# Altium project CubeSat-Backplane.PrjPcb (part 2 of 2)

## Sheet LED DRIVER.SchDoc: LED DRIVER
size B; CompanyName: ENGINEERING & TECHNICAL SERVICES; DrawnBy: C. Kornowski; Engineer: C. Kornowski; Organization: TECHNOLOGY DEVELOPMENT & ENGINEERING CENTER; Address1: 11401 HOOVER ROAD; Address2: MILAN, OH  44846; DocumentNumber: RD17-700*; SheetNumber: 5; PageSetup: Record=PageOptions|CenterHorizontal=True|CenterVertical=True|PrintScale=1.09|XCorrection=1.00|YCorrection=1.00|PrintKind=1|BorderSize=5000000|LeftOffset=0|BottomOffset=0|Orientation=2|PaperLength=1000|PaperWidth=1000|Scale=100|PaperSource=7|PrintQuality=600|MediaType=1|DitherType=10|PaperKind=11x17|PrintScaleMode=1
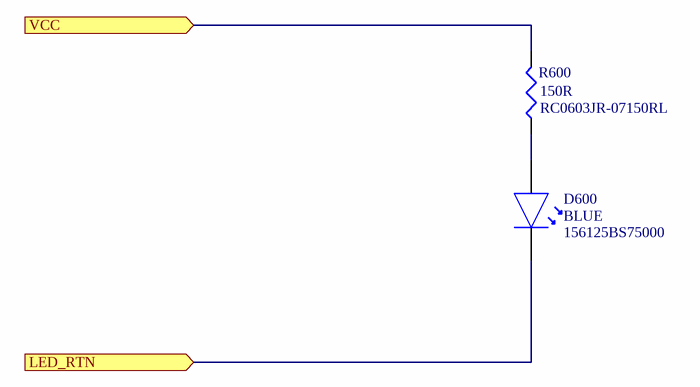
[diagram p4: LED DRIVER.SchDoc]

### Parts
D600  BLUE  [WL-SMRW_1205_BLU]
R600  150R  Manufacturer Part Number 1: RC0603JR-07150RL  [0603]

### Ports
LED_RTN (in), VCC (in)

### Nets
LED_RTN: D600.K ; port LED_RTN
VCC: R600.2 ; port VCC
NetD600_A: D600.A R600.1

### Notes on the sheet
- DCN
- REV
- DESCRIPTION
- REVISION HISTORY
- DATE
- APPROVED
- SIZE
- TITLE
- CAGE CODE
- DWG NO.
- DRAWN BY
- B
- 01HY9
- ENGINEER
- FILE NAME
- SHEET
- PRINTED:
- OF

### Library data of the parts
D600 = 156125BS75000: WL-SMRW SMD MONO-COLOR REVERSE MOUNT. Blue 470nm LED Indication - Discrete 3.2V 1205 (3212 Metric); Manufacturer 1: Wurth Electronics; Supplier 1: Digi-Key; Supplier Part Number 1: 732-13392-1-ND; Stock 1: 2740; Pricing 1: 1=0.40000, 10=0.34800, 100=0.31000, 500=0.28200, 1000=0.26156 (USD); RoHS: No; Manufacturer Part Number 1: 156125BS75000
R600 = RES1: RES SMD 150 OHM 5% 1/10W 0603; Manufacturer 1: Yageo; Voltage Rating (DC): 50V; Temperature Coefficient: 100ppm/°C; Power Rating: 100mW; ComponentLink1URL: https://datasheet.ciiva.com/2454/pyu-r-int-thick-7-2454513.pdf?src-supplier=Digi-Key; ComponentLink1Description: https://datasheet.ciiva.com/2454/pyu-r-int-thick-7-2454513.pdf?src-supplier=Digi-Key; ComponentLink2URL: https://datasheet.ciiva.com/2454/pyu-r-int-thick-7-2454514.pdf?src-supplier=Digi-Key; ComponentLink2Description: https://datasheet.ciiva.com/2454/pyu-r-int-thick-7-2454514.pdf?src-supplier=Digi-Key; ComponentLink3URL: https://datasheet.ciiva.com/2454/pyu-r-int-thick-7-2454515.pdf?src-supplier=Digi-Key; ComponentLink3Description: https://datasheet.ciiva.com/2454/pyu-r-int-thick-7-2454515.pdf?src-supplier=Digi-Key; ComponentLink4URL: https://datasheet.ciiva.com/46440/1868787-46440895.pdf?src-supplier=Element14; ComponentLink4Description: https://datasheet.ciiva.com/46440/1868787-46440895.pdf?src-supplier=Element14; Supplier 1: Digi-Key; Supplier Part Number 1: 311-150GRCT-ND; Stock 1: 2413445; Pricing 1: 1=0.10000, 10=0.01900, 100=0.00770, 1000=0.00347, 2500=0.00301 (USD); RoHS: Yes; Case/Package: 0603; Number of Pins: 2; Case Code (Imperial): 0603; Case Code (Metric): 1608; Min Operating Temperature: -55°C; Max Operating Temperature: 155°C; Value: 150R; Tolerance: 5%; Packaging: Tape and Reel; Composition: Thick Film; Voltage Rating: 50V; Termination: SMD/SMT; Military Standard: Not; Length: 1.6mm; Width: 0.8mm; Depth: 0.8mm; REACH SVHC: No SVHC; Lead Free: Lead Free; ComponentLink5URL: https://datasheet.ciiva.com/7746/443971-7746441.pdf?src-supplier=Element14; ComponentLink5Description: https://datasheet.ciiva.com/7746/443971-7746441.pdf?src-supplier=Element14; ComponentLink6URL: https://datasheet.ciiva.com/7746/443971-7746442.pdf?src-supplier=Element14; ComponentLink6Description: https://datasheet.ciiva.com/7746/443971-7746442.pdf?src-supplier=Element14; ComponentLink7URL: https://datasheet.ciiva.com/46395/443971-46395087.pdf?src-supplier=Element14; ComponentLink7Description: https://datasheet.ciiva.com/46395/443971-46395087.pdf?src-supplier=Element14

## Nets that join several sheets
GND: CubeSat Backplane (23 pins), PCB_CON1 (5 pins), PCB_CON2 (5 pins), PCB_CON3 (5 pins), PCB_CON4 (5 pins), PCB_CON5 (5 pins), PCB_CON6 (5 pins), PCB_CON7 (5 pins), PCB_CON8 (5 pins), Backplane LED's (7 pins)
5V_USB: PCB_CON1 (J200_1.70), PCB_CON2 (J200_2.70), PCB_CON3 (J200_3.70), PCB_CON4 (J200_4.70), PCB_CON5 (J200_5.70), PCB_CON6 (J200_6.70), PCB_CON7 (J200_7.70), PCB_CON8 (J200_8.70), Backplane LED's (9 pins)
+X_SOLAR_PWR: CubeSat Backplane (J105.1), PCB_CON1 (J200_1.8), PCB_CON2 (J200_2.8), PCB_CON3 (J200_3.8), PCB_CON4 (J200_4.8), PCB_CON5 (J200_5.8), PCB_CON6 (J200_6.8), PCB_CON7 (J200_7.8), PCB_CON8 (J200_8.8)
+X_SOLAR_RTN: CubeSat Backplane (J105.2), PCB_CON1 (J200_1.6), PCB_CON2 (J200_2.6), PCB_CON3 (J200_3.6), PCB_CON4 (J200_4.6), PCB_CON5 (J200_5.6), PCB_CON6 (J200_6.6), PCB_CON7 (J200_7.6), PCB_CON8 (J200_8.6)
+X_SOLAR_TLE: CubeSat Backplane (J105.3), PCB_CON1 (J200_1.4), PCB_CON2 (J200_2.4), PCB_CON3 (J200_3.4), PCB_CON4 (J200_4.4), PCB_CON5 (J200_5.4), PCB_CON6 (J200_6.4), PCB_CON7 (J200_7.4), PCB_CON8 (J200_8.4)
+Y_SOLAR_PWR: CubeSat Backplane (J107.1), PCB_CON1 (J200_1.117), PCB_CON2 (J200_2.117), PCB_CON3 (J200_3.117), PCB_CON4 (J200_4.117), PCB_CON5 (J200_5.117), PCB_CON6 (J200_6.117), PCB_CON7 (J200_7.117), PCB_CON8 (J200_8.117)
+Y_SOLAR_RTN: CubeSat Backplane (J107.2), PCB_CON1 (J200_1.115), PCB_CON2 (J200_2.115), PCB_CON3 (J200_3.115), PCB_CON4 (J200_4.115), PCB_CON5 (J200_5.115), PCB_CON6 (J200_6.115), PCB_CON7 (J200_7.115), PCB_CON8 (J200_8.115)
+Y_SOLAR_TLE: CubeSat Backplane (J107.3), PCB_CON1 (J200_1.113), PCB_CON2 (J200_2.113), PCB_CON3 (J200_3.113), PCB_CON4 (J200_4.113), PCB_CON5 (J200_5.113), PCB_CON6 (J200_6.113), PCB_CON7 (J200_7.113), PCB_CON8 (J200_8.113)
-X_SOLAR_PWR: CubeSat Backplane (J106.1), PCB_CON1 (J200_1.118), PCB_CON2 (J200_2.118), PCB_CON3 (J200_3.118), PCB_CON4 (J200_4.118), PCB_CON5 (J200_5.118), PCB_CON6 (J200_6.118), PCB_CON7 (J200_7.118), PCB_CON8 (J200_8.118)
-X_SOLAR_RTN: CubeSat Backplane (J106.2), PCB_CON1 (J200_1.116), PCB_CON2 (J200_2.116), PCB_CON3 (J200_3.116), PCB_CON4 (J200_4.116), PCB_CON5 (J200_5.116), PCB_CON6 (J200_6.116), PCB_CON7 (J200_7.116), PCB_CON8 (J200_8.116)
-X_SOLAR_TLE: CubeSat Backplane (J106.3), PCB_CON1 (J200_1.114), PCB_CON2 (J200_2.114), PCB_CON3 (J200_3.114), PCB_CON4 (J200_4.114), PCB_CON5 (J200_5.114), PCB_CON6 (J200_6.114), PCB_CON7 (J200_7.114), PCB_CON8 (J200_8.114)
-Z_SOLAR_PWR: CubeSat Backplane (J100.9), PCB_CON1 (J200_1.7), PCB_CON2 (J200_2.7), PCB_CON3 (J200_3.7), PCB_CON4 (J200_4.7), PCB_CON5 (J200_5.7), PCB_CON6 (J200_6.7), PCB_CON7 (J200_7.7), PCB_CON8 (J200_8.7)
-Z_SOLAR_RTN: CubeSat Backplane (J100.10), PCB_CON1 (J200_1.5), PCB_CON2 (J200_2.5), PCB_CON3 (J200_3.5), PCB_CON4 (J200_4.5), PCB_CON5 (J200_5.5), PCB_CON6 (J200_6.5), PCB_CON7 (J200_7.5), PCB_CON8 (J200_8.5)
-Z_SOLAR_TLE: CubeSat Backplane (J100.11), PCB_CON1 (J200_1.3), PCB_CON2 (J200_2.3), PCB_CON3 (J200_3.3), PCB_CON4 (J200_4.3), PCB_CON5 (J200_5.3), PCB_CON6 (J200_6.3), PCB_CON7 (J200_7.3), PCB_CON8 (J200_8.3)
AGND: PCB_CON1 (J200_1.71), PCB_CON2 (J200_2.71), PCB_CON3 (J200_3.71), PCB_CON4 (J200_4.71), PCB_CON5 (J200_5.71), PCB_CON6 (J200_6.71), PCB_CON7 (J200_7.71), PCB_CON8 (J200_8.71)
BUS_RESET: CubeSat Backplane (S100.1), PCB_CON1 (J200_1.65), PCB_CON2 (J200_2.65), PCB_CON3 (J200_3.65), PCB_CON4 (J200_4.65), PCB_CON5 (J200_5.65), PCB_CON6 (J200_6.65), PCB_CON7 (J200_7.65), PCB_CON8 (J200_8.65)
NetJ200_1_9: PCB_CON1 (J200_1.9), PCB_CON2 (J200_2.9), PCB_CON3 (J200_3.9), PCB_CON4 (J200_4.9), PCB_CON5 (J200_5.9), PCB_CON6 (J200_6.9), PCB_CON7 (J200_7.9), PCB_CON8 (J200_8.9)
NetJ200_1_10: PCB_CON1 (J200_1.10), PCB_CON2 (J200_2.10), PCB_CON3 (J200_3.10), PCB_CON4 (J200_4.10), PCB_CON5 (J200_5.10), PCB_CON6 (J200_6.10), PCB_CON7 (J200_7.10), PCB_CON8 (J200_8.10)
NetJ200_1_11: PCB_CON1 (J200_1.11), PCB_CON2 (J200_2.11), PCB_CON3 (J200_3.11), PCB_CON4 (J200_4.11), PCB_CON5 (J200_5.11), PCB_CON6 (J200_6.11), PCB_CON7 (J200_7.11), PCB_CON8 (J200_8.11)
NetJ200_1_12: PCB_CON1 (J200_1.12), PCB_CON2 (J200_2.12), PCB_CON3 (J200_3.12), PCB_CON4 (J200_4.12), PCB_CON5 (J200_5.12), PCB_CON6 (J200_6.12), PCB_CON7 (J200_7.12), PCB_CON8 (J200_8.12)
NetJ200_1_13: PCB_CON1 (J200_1.13), PCB_CON2 (J200_2.13), PCB_CON3 (J200_3.13), PCB_CON4 (J200_4.13), PCB_CON5 (J200_5.13), PCB_CON6 (J200_6.13), PCB_CON7 (J200_7.13), PCB_CON8 (J200_8.13)
NetJ200_1_14: PCB_CON1 (J200_1.14), PCB_CON2 (J200_2.14), PCB_CON3 (J200_3.14), PCB_CON4 (J200_4.14), PCB_CON5 (J200_5.14), PCB_CON6 (J200_6.14), PCB_CON7 (J200_7.14), PCB_CON8 (J200_8.14)
NetJ200_1_15: PCB_CON1 (J200_1.15), PCB_CON2 (J200_2.15), PCB_CON3 (J200_3.15), PCB_CON4 (J200_4.15), PCB_CON5 (J200_5.15), PCB_CON6 (J200_6.15), PCB_CON7 (J200_7.15), PCB_CON8 (J200_8.15)
NetJ200_1_16: PCB_CON1 (J200_1.16), PCB_CON2 (J200_2.16), PCB_CON3 (J200_3.16), PCB_CON4 (J200_4.16), PCB_CON5 (J200_5.16), PCB_CON6 (J200_6.16), PCB_CON7 (J200_7.16), PCB_CON8 (J200_8.16)
NetJ200_1_17: PCB_CON1 (J200_1.17), PCB_CON2 (J200_2.17), PCB_CON3 (J200_3.17), PCB_CON4 (J200_4.17), PCB_CON5 (J200_5.17), PCB_CON6 (J200_6.17), PCB_CON7 (J200_7.17), PCB_CON8 (J200_8.17)
NetJ200_1_18: PCB_CON1 (J200_1.18), PCB_CON2 (J200_2.18), PCB_CON3 (J200_3.18), PCB_CON4 (J200_4.18), PCB_CON5 (J200_5.18), PCB_CON6 (J200_6.18), PCB_CON7 (J200_7.18), PCB_CON8 (J200_8.18)
NetJ200_1_19: PCB_CON1 (J200_1.19), PCB_CON2 (J200_2.19), PCB_CON3 (J200_3.19), PCB_CON4 (J200_4.19), PCB_CON5 (J200_5.19), PCB_CON6 (J200_6.19), PCB_CON7 (J200_7.19), PCB_CON8 (J200_8.19)
NetJ200_1_20: PCB_CON1 (J200_1.20), PCB_CON2 (J200_2.20), PCB_CON3 (J200_3.20), PCB_CON4 (J200_4.20), PCB_CON5 (J200_5.20), PCB_CON6 (J200_6.20), PCB_CON7 (J200_7.20), PCB_CON8 (J200_8.20)
NetJ200_1_21: PCB_CON1 (J200_1.21), PCB_CON2 (J200_2.21), PCB_CON3 (J200_3.21), PCB_CON4 (J200_4.21), PCB_CON5 (J200_5.21), PCB_CON6 (J200_6.21), PCB_CON7 (J200_7.21), PCB_CON8 (J200_8.21)
NetJ200_1_22: PCB_CON1 (J200_1.22), PCB_CON2 (J200_2.22), PCB_CON3 (J200_3.22), PCB_CON4 (J200_4.22), PCB_CON5 (J200_5.22), PCB_CON6 (J200_6.22), PCB_CON7 (J200_7.22), PCB_CON8 (J200_8.22)
NetJ200_1_23: PCB_CON1 (J200_1.23), PCB_CON2 (J200_2.23), PCB_CON3 (J200_3.23), PCB_CON4 (J200_4.23), PCB_CON5 (J200_5.23), PCB_CON6 (J200_6.23), PCB_CON7 (J200_7.23), PCB_CON8 (J200_8.23)
NetJ200_1_24: PCB_CON1 (J200_1.24), PCB_CON2 (J200_2.24), PCB_CON3 (J200_3.24), PCB_CON4 (J200_4.24), PCB_CON5 (J200_5.24), PCB_CON6 (J200_6.24), PCB_CON7 (J200_7.24), PCB_CON8 (J200_8.24)
NetJ200_1_25: PCB_CON1 (J200_1.25), PCB_CON2 (J200_2.25), PCB_CON3 (J200_3.25), PCB_CON4 (J200_4.25), PCB_CON5 (J200_5.25), PCB_CON6 (J200_6.25), PCB_CON7 (J200_7.25), PCB_CON8 (J200_8.25)
NetJ200_1_26: PCB_CON1 (J200_1.26), PCB_CON2 (J200_2.26), PCB_CON3 (J200_3.26), PCB_CON4 (J200_4.26), PCB_CON5 (J200_5.26), PCB_CON6 (J200_6.26), PCB_CON7 (J200_7.26), PCB_CON8 (J200_8.26)
NetJ200_1_27: PCB_CON1 (J200_1.27), PCB_CON2 (J200_2.27), PCB_CON3 (J200_3.27), PCB_CON4 (J200_4.27), PCB_CON5 (J200_5.27), PCB_CON6 (J200_6.27), PCB_CON7 (J200_7.27), PCB_CON8 (J200_8.27)
NetJ200_1_28: PCB_CON1 (J200_1.28), PCB_CON2 (J200_2.28), PCB_CON3 (J200_3.28), PCB_CON4 (J200_4.28), PCB_CON5 (J200_5.28), PCB_CON6 (J200_6.28), PCB_CON7 (J200_7.28), PCB_CON8 (J200_8.28)
NetJ200_1_29: PCB_CON1 (J200_1.29), PCB_CON2 (J200_2.29), PCB_CON3 (J200_3.29), PCB_CON4 (J200_4.29), PCB_CON5 (J200_5.29), PCB_CON6 (J200_6.29), PCB_CON7 (J200_7.29), PCB_CON8 (J200_8.29)
NetJ200_1_30: PCB_CON1 (J200_1.30), PCB_CON2 (J200_2.30), PCB_CON3 (J200_3.30), PCB_CON4 (J200_4.30), PCB_CON5 (J200_5.30), PCB_CON6 (J200_6.30), PCB_CON7 (J200_7.30), PCB_CON8 (J200_8.30)
NetJ200_1_31: PCB_CON1 (J200_1.31), PCB_CON2 (J200_2.31), PCB_CON3 (J200_3.31), PCB_CON4 (J200_4.31), PCB_CON5 (J200_5.31), PCB_CON6 (J200_6.31), PCB_CON7 (J200_7.31), PCB_CON8 (J200_8.31)
NetJ200_1_32: PCB_CON1 (J200_1.32), PCB_CON2 (J200_2.32), PCB_CON3 (J200_3.32), PCB_CON4 (J200_4.32), PCB_CON5 (J200_5.32), PCB_CON6 (J200_6.32), PCB_CON7 (J200_7.32), PCB_CON8 (J200_8.32)
NetJ200_1_33: PCB_CON1 (J200_1.33), PCB_CON2 (J200_2.33), PCB_CON3 (J200_3.33), PCB_CON4 (J200_4.33), PCB_CON5 (J200_5.33), PCB_CON6 (J200_6.33), PCB_CON7 (J200_7.33), PCB_CON8 (J200_8.33)
NetJ200_1_34: PCB_CON1 (J200_1.34), PCB_CON2 (J200_2.34), PCB_CON3 (J200_3.34), PCB_CON4 (J200_4.34), PCB_CON5 (J200_5.34), PCB_CON6 (J200_6.34), PCB_CON7 (J200_7.34), PCB_CON8 (J200_8.34)
NetJ200_1_35: PCB_CON1 (J200_1.35), PCB_CON2 (J200_2.35), PCB_CON3 (J200_3.35), PCB_CON4 (J200_4.35), PCB_CON5 (J200_5.35), PCB_CON6 (J200_6.35), PCB_CON7 (J200_7.35), PCB_CON8 (J200_8.35)
NetJ200_1_36: PCB_CON1 (J200_1.36), PCB_CON2 (J200_2.36), PCB_CON3 (J200_3.36), PCB_CON4 (J200_4.36), PCB_CON5 (J200_5.36), PCB_CON6 (J200_6.36), PCB_CON7 (J200_7.36), PCB_CON8 (J200_8.36)
NetJ200_1_38: PCB_CON1 (J200_1.38), PCB_CON2 (J200_2.38), PCB_CON3 (J200_3.38), PCB_CON4 (J200_4.38), PCB_CON5 (J200_5.38), PCB_CON6 (J200_6.38), PCB_CON7 (J200_7.38), PCB_CON8 (J200_8.38)
NetJ200_1_39: PCB_CON1 (J200_1.39), PCB_CON2 (J200_2.39), PCB_CON3 (J200_3.39), PCB_CON4 (J200_4.39), PCB_CON5 (J200_5.39), PCB_CON6 (J200_6.39), PCB_CON7 (J200_7.39), PCB_CON8 (J200_8.39)
NetJ200_1_40: PCB_CON1 (J200_1.40), PCB_CON2 (J200_2.40), PCB_CON3 (J200_3.40), PCB_CON4 (J200_4.40), PCB_CON5 (J200_5.40), PCB_CON6 (J200_6.40), PCB_CON7 (J200_7.40), PCB_CON8 (J200_8.40)
NetJ200_1_41: PCB_CON1 (J200_1.41), PCB_CON2 (J200_2.41), PCB_CON3 (J200_3.41), PCB_CON4 (J200_4.41), PCB_CON5 (J200_5.41), PCB_CON6 (J200_6.41), PCB_CON7 (J200_7.41), PCB_CON8 (J200_8.41)
NetJ200_1_42: PCB_CON1 (J200_1.42), PCB_CON2 (J200_2.42), PCB_CON3 (J200_3.42), PCB_CON4 (J200_4.42), PCB_CON5 (J200_5.42), PCB_CON6 (J200_6.42), PCB_CON7 (J200_7.42), PCB_CON8 (J200_8.42)
NetJ200_1_43: PCB_CON1 (J200_1.43), PCB_CON2 (J200_2.43), PCB_CON3 (J200_3.43), PCB_CON4 (J200_4.43), PCB_CON5 (J200_5.43), PCB_CON6 (J200_6.43), PCB_CON7 (J200_7.43), PCB_CON8 (J200_8.43)
NetJ200_1_44: PCB_CON1 (J200_1.44), PCB_CON2 (J200_2.44), PCB_CON3 (J200_3.44), PCB_CON4 (J200_4.44), PCB_CON5 (J200_5.44), PCB_CON6 (J200_6.44), PCB_CON7 (J200_7.44), PCB_CON8 (J200_8.44)
NetJ200_1_45: PCB_CON1 (J200_1.45), PCB_CON2 (J200_2.45), PCB_CON3 (J200_3.45), PCB_CON4 (J200_4.45), PCB_CON5 (J200_5.45), PCB_CON6 (J200_6.45), PCB_CON7 (J200_7.45), PCB_CON8 (J200_8.45)
NetJ200_1_46: PCB_CON1 (J200_1.46), PCB_CON2 (J200_2.46), PCB_CON3 (J200_3.46), PCB_CON4 (J200_4.46), PCB_CON5 (J200_5.46), PCB_CON6 (J200_6.46), PCB_CON7 (J200_7.46), PCB_CON8 (J200_8.46)
NetJ200_1_47: PCB_CON1 (J200_1.47), PCB_CON2 (J200_2.47), PCB_CON3 (J200_3.47), PCB_CON4 (J200_4.47), PCB_CON5 (J200_5.47), PCB_CON6 (J200_6.47), PCB_CON7 (J200_7.47), PCB_CON8 (J200_8.47)
NetJ200_1_48: PCB_CON1 (J200_1.48), PCB_CON2 (J200_2.48), PCB_CON3 (J200_3.48), PCB_CON4 (J200_4.48), PCB_CON5 (J200_5.48), PCB_CON6 (J200_6.48), PCB_CON7 (J200_7.48), PCB_CON8 (J200_8.48)
NetJ200_1_49: PCB_CON1 (J200_1.49), PCB_CON2 (J200_2.49), PCB_CON3 (J200_3.49), PCB_CON4 (J200_4.49), PCB_CON5 (J200_5.49), PCB_CON6 (J200_6.49), PCB_CON7 (J200_7.49), PCB_CON8 (J200_8.49)
NetJ200_1_50: PCB_CON1 (J200_1.50), PCB_CON2 (J200_2.50), PCB_CON3 (J200_3.50), PCB_CON4 (J200_4.50), PCB_CON5 (J200_5.50), PCB_CON6 (J200_6.50), PCB_CON7 (J200_7.50), PCB_CON8 (J200_8.50)
NetJ200_1_51: PCB_CON1 (J200_1.51), PCB_CON2 (J200_2.51), PCB_CON3 (J200_3.51), PCB_CON4 (J200_4.51), PCB_CON5 (J200_5.51), PCB_CON6 (J200_6.51), PCB_CON7 (J200_7.51), PCB_CON8 (J200_8.51)
NetJ200_1_52: PCB_CON1 (J200_1.52), PCB_CON2 (J200_2.52), PCB_CON3 (J200_3.52), PCB_CON4 (J200_4.52), PCB_CON5 (J200_5.52), PCB_CON6 (J200_6.52), PCB_CON7 (J200_7.52), PCB_CON8 (J200_8.52)
NetJ200_1_53: PCB_CON1 (J200_1.53), PCB_CON2 (J200_2.53), PCB_CON3 (J200_3.53), PCB_CON4 (J200_4.53), PCB_CON5 (J200_5.53), PCB_CON6 (J200_6.53), PCB_CON7 (J200_7.53), PCB_CON8 (J200_8.53)
NetJ200_1_54: PCB_CON1 (J200_1.54), PCB_CON2 (J200_2.54), PCB_CON3 (J200_3.54), PCB_CON4 (J200_4.54), PCB_CON5 (J200_5.54), PCB_CON6 (J200_6.54), PCB_CON7 (J200_7.54), PCB_CON8 (J200_8.54)
NetJ200_1_55: PCB_CON1 (J200_1.55), PCB_CON2 (J200_2.55), PCB_CON3 (J200_3.55), PCB_CON4 (J200_4.55), PCB_CON5 (J200_5.55), PCB_CON6 (J200_6.55), PCB_CON7 (J200_7.55), PCB_CON8 (J200_8.55)
NetJ200_1_56: PCB_CON1 (J200_1.56), PCB_CON2 (J200_2.56), PCB_CON3 (J200_3.56), PCB_CON4 (J200_4.56), PCB_CON5 (J200_5.56), PCB_CON6 (J200_6.56), PCB_CON7 (J200_7.56), PCB_CON8 (J200_8.56)
NetJ200_1_57: PCB_CON1 (J200_1.57), PCB_CON2 (J200_2.57), PCB_CON3 (J200_3.57), PCB_CON4 (J200_4.57), PCB_CON5 (J200_5.57), PCB_CON6 (J200_6.57), PCB_CON7 (J200_7.57), PCB_CON8 (J200_8.57)
NetJ200_1_58: PCB_CON1 (J200_1.58), PCB_CON2 (J200_2.58), PCB_CON3 (J200_3.58), PCB_CON4 (J200_4.58), PCB_CON5 (J200_5.58), PCB_CON6 (J200_6.58), PCB_CON7 (J200_7.58), PCB_CON8 (J200_8.58)
NetJ200_1_59: PCB_CON1 (J200_1.59), PCB_CON2 (J200_2.59), PCB_CON3 (J200_3.59), PCB_CON4 (J200_4.59), PCB_CON5 (J200_5.59), PCB_CON6 (J200_6.59), PCB_CON7 (J200_7.59), PCB_CON8 (J200_8.59)
NetJ200_1_60: PCB_CON1 (J200_1.60), PCB_CON2 (J200_2.60), PCB_CON3 (J200_3.60), PCB_CON4 (J200_4.60), PCB_CON5 (J200_5.60), PCB_CON6 (J200_6.60), PCB_CON7 (J200_7.60), PCB_CON8 (J200_8.60)
NetJ200_1_61: PCB_CON1 (J200_1.61), PCB_CON2 (J200_2.61), PCB_CON3 (J200_3.61), PCB_CON4 (J200_4.61), PCB_CON5 (J200_5.61), PCB_CON6 (J200_6.61), PCB_CON7 (J200_7.61), PCB_CON8 (J200_8.61)
NetJ200_1_62: PCB_CON1 (J200_1.62), PCB_CON2 (J200_2.62), PCB_CON3 (J200_3.62), PCB_CON4 (J200_4.62), PCB_CON5 (J200_5.62), PCB_CON6 (J200_6.62), PCB_CON7 (J200_7.62), PCB_CON8 (J200_8.62)
NetJ200_1_63: PCB_CON1 (J200_1.63), PCB_CON2 (J200_2.63), PCB_CON3 (J200_3.63), PCB_CON4 (J200_4.63), PCB_CON5 (J200_5.63), PCB_CON6 (J200_6.63), PCB_CON7 (J200_7.63), PCB_CON8 (J200_8.63)
NetJ200_1_64: PCB_CON1 (J200_1.64), PCB_CON2 (J200_2.64), PCB_CON3 (J200_3.64), PCB_CON4 (J200_4.64), PCB_CON5 (J200_5.64), PCB_CON6 (J200_6.64), PCB_CON7 (J200_7.64), PCB_CON8 (J200_8.64)
NetJ200_1_66: PCB_CON1 (J200_1.66), PCB_CON2 (J200_2.66), PCB_CON3 (J200_3.66), PCB_CON4 (J200_4.66), PCB_CON5 (J200_5.66), PCB_CON6 (J200_6.66), PCB_CON7 (J200_7.66), PCB_CON8 (J200_8.66)
NetJ200_1_69: PCB_CON1 (J200_1.69), PCB_CON2 (J200_2.69), PCB_CON3 (J200_3.69), PCB_CON4 (J200_4.69), PCB_CON5 (J200_5.69), PCB_CON6 (J200_6.69), PCB_CON7 (J200_7.69), PCB_CON8 (J200_8.69)
NetJ200_1_73: PCB_CON1 (J200_1.73), PCB_CON2 (J200_2.73), PCB_CON3 (J200_3.73), PCB_CON4 (J200_4.73), PCB_CON5 (J200_5.73), PCB_CON6 (J200_6.73), PCB_CON7 (J200_7.73), PCB_CON8 (J200_8.73)
NetJ200_1_74: PCB_CON1 (J200_1.74), PCB_CON2 (J200_2.74), PCB_CON3 (J200_3.74), PCB_CON4 (J200_4.74), PCB_CON5 (J200_5.74), PCB_CON6 (J200_6.74), PCB_CON7 (J200_7.74), PCB_CON8 (J200_8.74)
NetJ200_1_75: PCB_CON1 (J200_1.75), PCB_CON2 (J200_2.75), PCB_CON3 (J200_3.75), PCB_CON4 (J200_4.75), PCB_CON5 (J200_5.75), PCB_CON6 (J200_6.75), PCB_CON7 (J200_7.75), PCB_CON8 (J200_8.75)
NetJ200_1_76: PCB_CON1 (J200_1.76), PCB_CON2 (J200_2.76), PCB_CON3 (J200_3.76), PCB_CON4 (J200_4.76), PCB_CON5 (J200_5.76), PCB_CON6 (J200_6.76), PCB_CON7 (J200_7.76), PCB_CON8 (J200_8.76)
NetJ200_1_77: PCB_CON1 (J200_1.77), PCB_CON2 (J200_2.77), PCB_CON3 (J200_3.77), PCB_CON4 (J200_4.77), PCB_CON5 (J200_5.77), PCB_CON6 (J200_6.77), PCB_CON7 (J200_7.77), PCB_CON8 (J200_8.77)
NetJ200_1_78: PCB_CON1 (J200_1.78), PCB_CON2 (J200_2.78), PCB_CON3 (J200_3.78), PCB_CON4 (J200_4.78), PCB_CON5 (J200_5.78), PCB_CON6 (J200_6.78), PCB_CON7 (J200_7.78), PCB_CON8 (J200_8.78)
NetJ200_1_79: PCB_CON1 (J200_1.79), PCB_CON2 (J200_2.79), PCB_CON3 (J200_3.79), PCB_CON4 (J200_4.79), PCB_CON5 (J200_5.79), PCB_CON6 (J200_6.79), PCB_CON7 (J200_7.79), PCB_CON8 (J200_8.79)
NetJ200_1_80: PCB_CON1 (J200_1.80), PCB_CON2 (J200_2.80), PCB_CON3 (J200_3.80), PCB_CON4 (J200_4.80), PCB_CON5 (J200_5.80), PCB_CON6 (J200_6.80), PCB_CON7 (J200_7.80), PCB_CON8 (J200_8.80)
NetJ200_1_81: PCB_CON1 (J200_1.81), PCB_CON2 (J200_2.81), PCB_CON3 (J200_3.81), PCB_CON4 (J200_4.81), PCB_CON5 (J200_5.81), PCB_CON6 (J200_6.81), PCB_CON7 (J200_7.81), PCB_CON8 (J200_8.81)
NetJ200_1_82: PCB_CON1 (J200_1.82), PCB_CON2 (J200_2.82), PCB_CON3 (J200_3.82), PCB_CON4 (J200_4.82), PCB_CON5 (J200_5.82), PCB_CON6 (J200_6.82), PCB_CON7 (J200_7.82), PCB_CON8 (J200_8.82)
NetJ200_1_83: PCB_CON1 (J200_1.83), PCB_CON2 (J200_2.83), PCB_CON3 (J200_3.83), PCB_CON4 (J200_4.83), PCB_CON5 (J200_5.83), PCB_CON6 (J200_6.83), PCB_CON7 (J200_7.83), PCB_CON8 (J200_8.83)
NetJ200_1_84: PCB_CON1 (J200_1.84), PCB_CON2 (J200_2.84), PCB_CON3 (J200_3.84), PCB_CON4 (J200_4.84), PCB_CON5 (J200_5.84), PCB_CON6 (J200_6.84), PCB_CON7 (J200_7.84), PCB_CON8 (J200_8.84)
NetJ200_1_85: PCB_CON1 (J200_1.85), PCB_CON2 (J200_2.85), PCB_CON3 (J200_3.85), PCB_CON4 (J200_4.85), PCB_CON5 (J200_5.85), PCB_CON6 (J200_6.85), PCB_CON7 (J200_7.85), PCB_CON8 (J200_8.85)
NetJ200_1_86: PCB_CON1 (J200_1.86), PCB_CON2 (J200_2.86), PCB_CON3 (J200_3.86), PCB_CON4 (J200_4.86), PCB_CON5 (J200_5.86), PCB_CON6 (J200_6.86), PCB_CON7 (J200_7.86), PCB_CON8 (J200_8.86)
NetJ200_1_87: PCB_CON1 (J200_1.87), PCB_CON2 (J200_2.87), PCB_CON3 (J200_3.87), PCB_CON4 (J200_4.87), PCB_CON5 (J200_5.87), PCB_CON6 (J200_6.87), PCB_CON7 (J200_7.87), PCB_CON8 (J200_8.87)
NetJ200_1_88: PCB_CON1 (J200_1.88), PCB_CON2 (J200_2.88), PCB_CON3 (J200_3.88), PCB_CON4 (J200_4.88), PCB_CON5 (J200_5.88), PCB_CON6 (J200_6.88), PCB_CON7 (J200_7.88), PCB_CON8 (J200_8.88)
NetJ200_1_89: PCB_CON1 (J200_1.89), PCB_CON2 (J200_2.89), PCB_CON3 (J200_3.89), PCB_CON4 (J200_4.89), PCB_CON5 (J200_5.89), PCB_CON6 (J200_6.89), PCB_CON7 (J200_7.89), PCB_CON8 (J200_8.89)
NetJ200_1_90: PCB_CON1 (J200_1.90), PCB_CON2 (J200_2.90), PCB_CON3 (J200_3.90), PCB_CON4 (J200_4.90), PCB_CON5 (J200_5.90), PCB_CON6 (J200_6.90), PCB_CON7 (J200_7.90), PCB_CON8 (J200_8.90)
NetJ200_1_91: PCB_CON1 (J200_1.91), PCB_CON2 (J200_2.91), PCB_CON3 (J200_3.91), PCB_CON4 (J200_4.91), PCB_CON5 (J200_5.91), PCB_CON6 (J200_6.91), PCB_CON7 (J200_7.91), PCB_CON8 (J200_8.91)
NetJ200_1_92: PCB_CON1 (J200_1.92), PCB_CON2 (J200_2.92), PCB_CON3 (J200_3.92), PCB_CON4 (J200_4.92), PCB_CON5 (J200_5.92), PCB_CON6 (J200_6.92), PCB_CON7 (J200_7.92), PCB_CON8 (J200_8.92)
NetJ200_1_93: PCB_CON1 (J200_1.93), PCB_CON2 (J200_2.93), PCB_CON3 (J200_3.93), PCB_CON4 (J200_4.93), PCB_CON5 (J200_5.93), PCB_CON6 (J200_6.93), PCB_CON7 (J200_7.93), PCB_CON8 (J200_8.93)
NetJ200_1_94: PCB_CON1 (J200_1.94), PCB_CON2 (J200_2.94), PCB_CON3 (J200_3.94), PCB_CON4 (J200_4.94), PCB_CON5 (J200_5.94), PCB_CON6 (J200_6.94), PCB_CON7 (J200_7.94), PCB_CON8 (J200_8.94)
NetJ200_1_95: PCB_CON1 (J200_1.95), PCB_CON2 (J200_2.95), PCB_CON3 (J200_3.95), PCB_CON4 (J200_4.95), PCB_CON5 (J200_5.95), PCB_CON6 (J200_6.95), PCB_CON7 (J200_7.95), PCB_CON8 (J200_8.95)
NetJ200_1_96: PCB_CON1 (J200_1.96), PCB_CON2 (J200_2.96), PCB_CON3 (J200_3.96), PCB_CON4 (J200_4.96), PCB_CON5 (J200_5.96), PCB_CON6 (J200_6.96), PCB_CON7 (J200_7.96), PCB_CON8 (J200_8.96)
NetJ200_1_97: PCB_CON1 (J200_1.97), PCB_CON2 (J200_2.97), PCB_CON3 (J200_3.97), PCB_CON4 (J200_4.97), PCB_CON5 (J200_5.97), PCB_CON6 (J200_6.97), PCB_CON7 (J200_7.97), PCB_CON8 (J200_8.97)
NetJ200_1_98: PCB_CON1 (J200_1.98), PCB_CON2 (J200_2.98), PCB_CON3 (J200_3.98), PCB_CON4 (J200_4.98), PCB_CON5 (J200_5.98), PCB_CON6 (J200_6.98), PCB_CON7 (J200_7.98), PCB_CON8 (J200_8.98)
NetJ200_1_99: PCB_CON1 (J200_1.99), PCB_CON2 (J200_2.99), PCB_CON3 (J200_3.99), PCB_CON4 (J200_4.99), PCB_CON5 (J200_5.99), PCB_CON6 (J200_6.99), PCB_CON7 (J200_7.99), PCB_CON8 (J200_8.99)
NetJ200_1_100: PCB_CON1 (J200_1.100), PCB_CON2 (J200_2.100), PCB_CON3 (J200_3.100), PCB_CON4 (J200_4.100), PCB_CON5 (J200_5.100), PCB_CON6 (J200_6.100), PCB_CON7 (J200_7.100), PCB_CON8 (J200_8.100)
NetJ200_1_106: PCB_CON1 (J200_1.106), PCB_CON2 (J200_2.106), PCB_CON3 (J200_3.106), PCB_CON4 (J200_4.106), PCB_CON5 (J200_5.106), PCB_CON6 (J200_6.106), PCB_CON7 (J200_7.106), PCB_CON8 (J200_8.106)
NetJ200_1_107: PCB_CON1 (J200_1.107), PCB_CON2 (J200_2.107), PCB_CON3 (J200_3.107), PCB_CON4 (J200_4.107), PCB_CON5 (J200_5.107), PCB_CON6 (J200_6.107), PCB_CON7 (J200_7.107), PCB_CON8 (J200_8.107)
NetJ200_1_108: PCB_CON1 (J200_1.108), PCB_CON2 (J200_2.108), PCB_CON3 (J200_3.108), PCB_CON4 (J200_4.108), PCB_CON5 (J200_5.108), PCB_CON6 (J200_6.108), PCB_CON7 (J200_7.108), PCB_CON8 (J200_8.108)
NetJ200_1_109: PCB_CON1 (J200_1.109), PCB_CON2 (J200_2.109), PCB_CON3 (J200_3.109), PCB_CON4 (J200_4.109), PCB_CON5 (J200_5.109), PCB_CON6 (J200_6.109), PCB_CON7 (J200_7.109), PCB_CON8 (J200_8.109)
NetJ200_1_110: PCB_CON1 (J200_1.110), PCB_CON2 (J200_2.110), PCB_CON3 (J200_3.110), PCB_CON4 (J200_4.110), PCB_CON5 (J200_5.110), PCB_CON6 (J200_6.110), PCB_CON7 (J200_7.110), PCB_CON8 (J200_8.110)
NetJ200_1_111: PCB_CON1 (J200_1.111), PCB_CON2 (J200_2.111), PCB_CON3 (J200_3.111), PCB_CON4 (J200_4.111), PCB_CON5 (J200_5.111), PCB_CON6 (J200_6.111), PCB_CON7 (J200_7.111), PCB_CON8 (J200_8.111)
NetJ200_1_112: PCB_CON1 (J200_1.112), PCB_CON2 (J200_2.112), PCB_CON3 (J200_3.112), PCB_CON4 (J200_4.112), PCB_CON5 (J200_5.112), PCB_CON6 (J200_6.112), PCB_CON7 (J200_7.112), PCB_CON8 (J200_8.112)
RBF: PCB_CON1 (J200_1.37), PCB_CON2 (J200_2.37), PCB_CON3 (J200_3.37), PCB_CON4 (J200_4.37), PCB_CON5 (J200_5.37), PCB_CON6 (J200_6.37), PCB_CON7 (J200_7.37), PCB_CON8 (J200_8.37)
SCL: CubeSat Backplane (R101.1), Backplane LED's (R500.1 U500.19)
SDA: CubeSat Backplane (R102.1), Backplane LED's (R501.1 U500.20)
SELF_TEST: CubeSat Backplane (S101.1), PCB_CON1 (J200_1.101), PCB_CON2 (J200_2.101), PCB_CON3 (J200_3.101), PCB_CON4 (J200_4.101), PCB_CON5 (J200_5.101), PCB_CON6 (J200_6.101), PCB_CON7 (J200_7.101), PCB_CON8 (J200_8.101)
SEP1: CubeSat Backplane (J100.1), PCB_CON1 (J200_1.1), PCB_CON2 (J200_2.1), PCB_CON3 (J200_3.1), PCB_CON4 (J200_4.1), PCB_CON5 (J200_5.1), PCB_CON6 (J200_6.1), PCB_CON7 (J200_7.1), PCB_CON8 (J200_8.1)
SEP2: CubeSat Backplane (J100.3), PCB_CON1 (J200_1.2), PCB_CON2 (J200_2.2), PCB_CON3 (J200_3.2), PCB_CON4 (J200_4.2), PCB_CON5 (J200_5.2), PCB_CON6 (J200_6.2), PCB_CON7 (J200_7.2), PCB_CON8 (J200_8.2)
SEP3: CubeSat Backplane (J100.5), PCB_CON1 (J200_1.119), PCB_CON2 (J200_2.119), PCB_CON3 (J200_3.119), PCB_CON4 (J200_4.119), PCB_CON5 (J200_5.119), PCB_CON6 (J200_6.119), PCB_CON7 (J200_7.119), PCB_CON8 (J200_8.119)
SEP4: CubeSat Backplane (J100.7), PCB_CON1 (J200_1.120), PCB_CON2 (J200_2.120), PCB_CON3 (J200_3.120), PCB_CON4 (J200_4.120), PCB_CON5 (J200_5.120), PCB_CON6 (J200_6.120), PCB_CON7 (J200_7.120), PCB_CON8 (J200_8.120)
USER_1: CubeSat Backplane (R101.2), PCB_CON1 (J200_1.102), PCB_CON2 (J200_2.102), PCB_CON3 (J200_3.102), PCB_CON4 (J200_4.102), PCB_CON5 (J200_5.102), PCB_CON6 (J200_6.102), PCB_CON7 (J200_7.102), PCB_CON8 (J200_8.102)
USER_2: CubeSat Backplane (R102.2), PCB_CON1 (J200_1.105), PCB_CON2 (J200_2.105), PCB_CON3 (J200_3.105), PCB_CON4 (J200_4.105), PCB_CON5 (J200_5.105), PCB_CON6 (J200_6.105), PCB_CON7 (J200_7.105), PCB_CON8 (J200_8.105)

## Assembly variants
Surface Mount: not fitted S700_1 S700_2 S700_3 S700_4
Through Hole: not fitted C500 C501 D600_1 D600_2 D600_3 D600_4 D600_5 D600_6 D600_7 D600_8 J104 J105 J106 J107 J200_1 J200_2 J200_3 J200_4 J200_5 J200_6 J200_7 J200_8 J300 J301 MH100 MH101 MH102 MH103 MH104 MH105 Q600_1 Q600_2 Q600_3 Q600_4 Q600_5 Q600_6 Q600_7 Q600_8 R100 R101 R102 R103 R104 R600_1 R600_2 R600_3 R600_4 R600_5 R600_6 R600_7 R600_8 R601_1 R601_2 R601_3 R601_4 R601_5 R601_6 R601_7 R601_8 R700_1 R700_2 R700_3 R700_4 R701_1 R701_2 R701_3 R701_4 S100 S101 U500